# EAGLE design Motor Control (EAGLE 6.0)

## Sheet 1 of 2
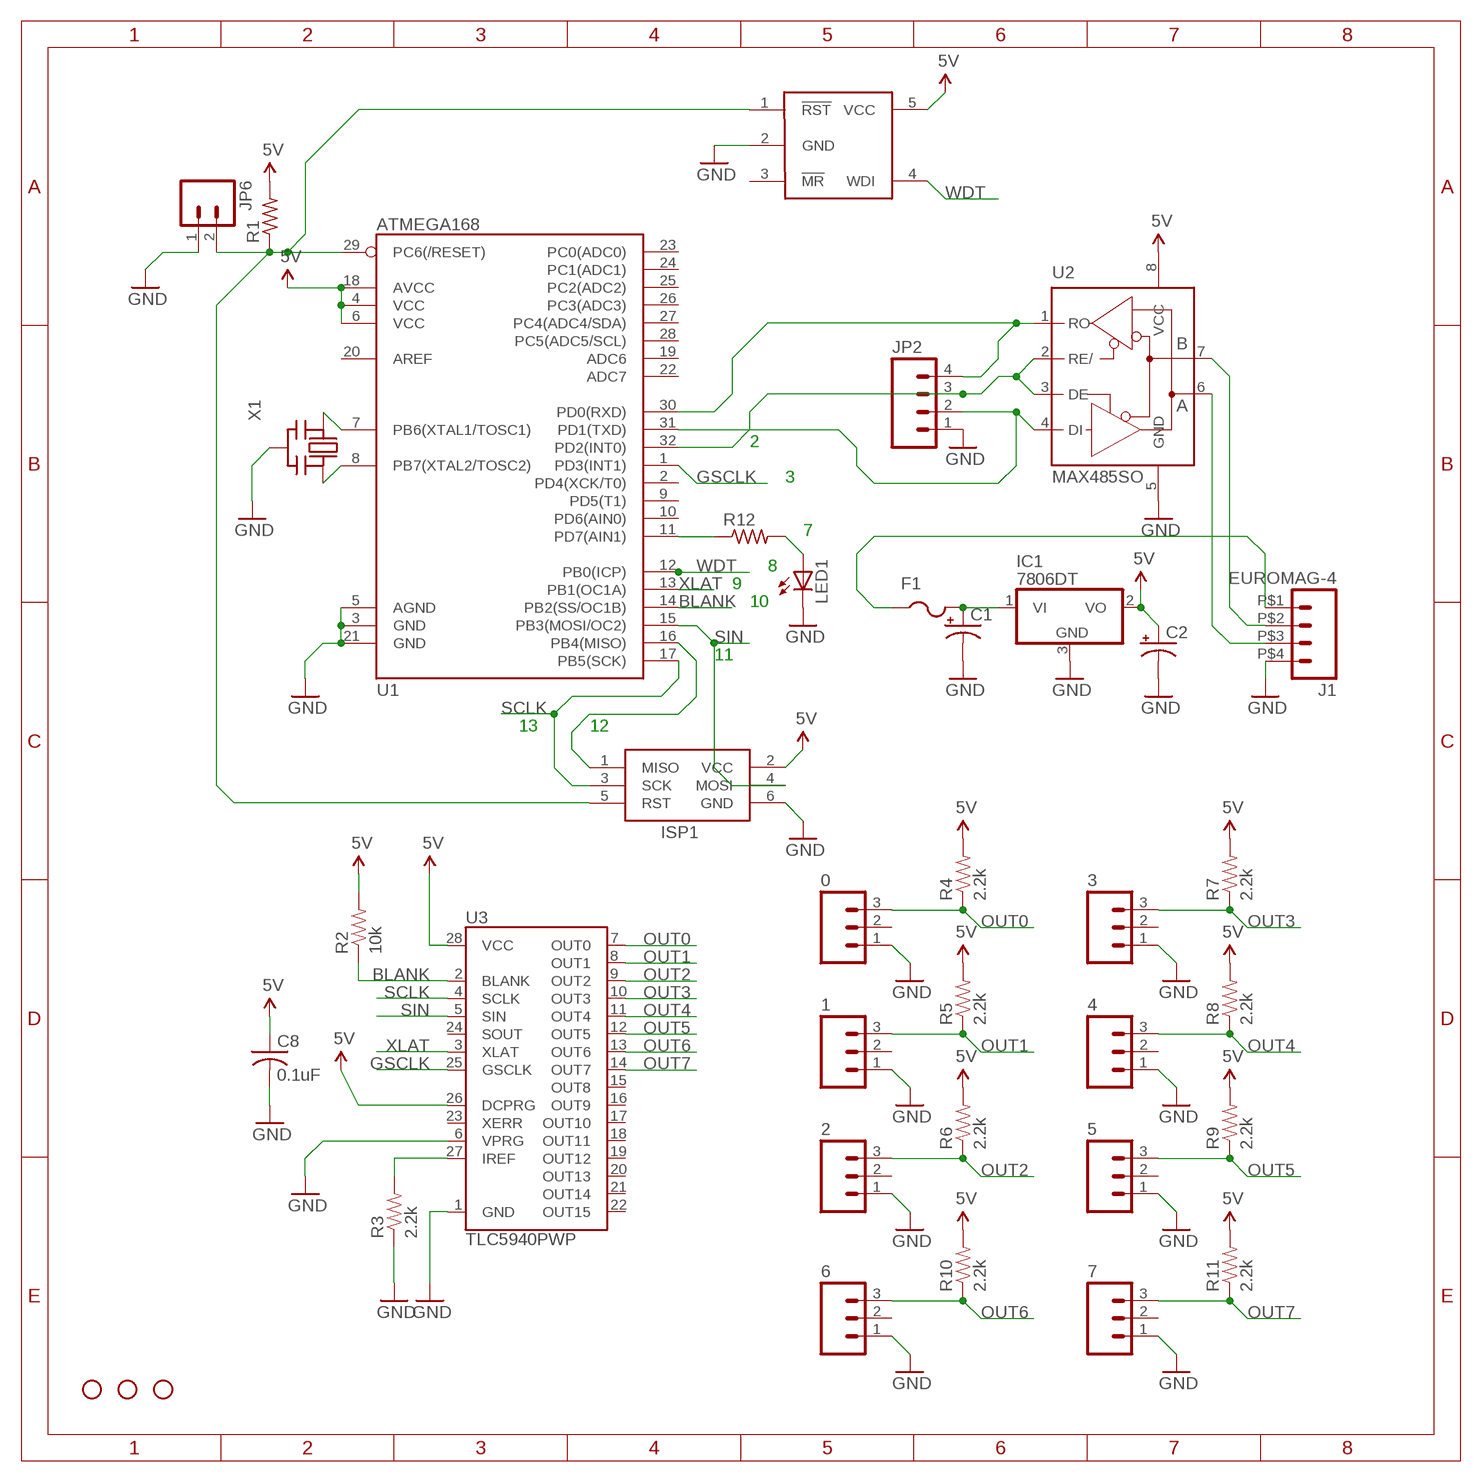
[diagram p0: schematic, sheet 1]

### Parts
0  M03PTH  [1X03]
1  M03PTH  [1X03]
2  M03PTH  [1X03]
3  M03PTH  [1X03]
4  M03PTH  [1X03]
5  M03PTH  [1X03]
6  M03PTH  [1X03]
7  M03PTH  [1X03]
C1  CPOL-USCT7343  [CT7343]
C2  CPOL-USCT6032  [CT6032]
C8  0.1uF  C-USC0603  [C0603]
F1  PTCFUSE-1812  [1812]
IC1  7806DT  [TO252]
ISP1  AVRISP-6  [AVRISP]
J1  EUROMAG-4  [M4]
JP2  M04PTH  [1X04]
JP3  STAND-OFF  [STAND-OFF]
JP4  STAND-OFF  [STAND-OFF]
JP5  STAND-OFF  [STAND-OFF]
JP6  M02LOCK_LONGPADS  [1X02_LOCK_LONGPADS]
LED1  LEDCHIPLED_0805  [CHIPLED_0805]
R1  R-US_M0805  [M0805]
R2  10k  RESISTOR0805-RES  [0805]
R3  2.2k  RESISTOR0805-RES  [0805]
R4  2.2k  RESISTOR0805-RES  [0805]
R5  2.2k  RESISTOR0805-RES  [0805]
R6  2.2k  RESISTOR0805-RES  [0805]
R7  2.2k  RESISTOR0805-RES  [0805]
R8  2.2k  RESISTOR0805-RES  [0805]
R9  2.2k  RESISTOR0805-RES  [0805]
R10  2.2k  RESISTOR0805-RES  [0805]
R11  2.2k  RESISTOR0805-RES  [0805]
R12  R-US_M0805  [M0805]
U1  ATMEGA168  [TQFP32-08]
U2  MAX485SO  [SO08]
U3  TLC5940PWP  [TSSOP28-GROUNDPAD]
U$18  MAX823  [SOT23-5L]
X1  CERMOSCILL-AWCSR  [AWCSR]

### Nets
5V: C2.+ C8.1 IC1.2(VO) ISP1.2(VCC) R1.2 R2.2 R4.2 R5.2 R6.2 R7.2 R8.2 R9.2 R10.2 R11.2 U1.4(VCC) U1.6(VCC) U1.18(AVCC) U2.8(VCC) U3.26(DCPRG) U3.28(VCC) U$18.5(VCC)
BLANK: R2.1 U1.14(PB2(SS/OC1B)) U3.2(BLANK)
GND: 0.1 1.1 2.1 3.1 4.1 5.1 6.1 7.1 C1.- C2.- C8.2 IC1.3(GND) ISP1.6(GND) J1.P$4 JP2.1 JP6.1 LED1.C R3.1 U1.3(GND) U1.5(AGND) U1.21(GND) U2.5(GND) U3.1(GND) U3.6(VPRG) U$18.2(GND) X1.2(GND) ; also sheet 2
GSCLK: U1.1(PD3(INT1)) U3.25(GSCLK)
N$1: JP2.3 U1.32(PD2(INT0)) U2.2(RE/) U2.3(DE)
N$2: JP2.4 U1.30(PD0(RXD)) U2.1(RO)
N$3: JP2.2 U1.31(PD1(TXD)) U2.4(DI)
N$4: ISP1.5(RST) JP6.2 R1.1 U1.29(PC6(/RESET)) U$18.1(!RST)
N$5: U1.8(PB7(XTAL2/TOSC2)) X1.3(OUT)
N$6: F1.1 J1.P$1
N$7: ISP1.1(MISO) U1.16(PB4(MISO))
N$8: C1.+ F1.2 IC1.1(VI)
N$9: U1.7(PB6(XTAL1/TOSC1)) X1.1(IN)
N$10: R3.2 U3.27(IREF)
N$11: J1.P$2 U2.7(B)
N$12: J1.P$3 U2.6(A)
N$17: R12.1 U1.11(PD7(AIN1))
N$20: LED1.A R12.2
OUT0: 0.3 R4.1 U3.7(OUT0)
OUT1: 1.3 R5.1 U3.8(OUT1)
OUT2: 2.3 R6.1 U3.9(OUT2)
OUT3: 3.3 R7.1 U3.10(OUT3)
OUT4: 4.3 R8.1 U3.11(OUT4)
OUT5: 5.3 R9.1 U3.12(OUT5)
OUT6: 6.3 R10.1 U3.13(OUT6)
OUT7: 7.3 R11.1 U3.14(OUT7)
SCLK: ISP1.3(SCK) U1.17(PB5(SCK)) U3.4(SCLK)
SIN: ISP1.4(MOSI) U1.15(PB3(MOSI/OC2)) U3.5(SIN)
WDT: U1.12(PB0(ICP)) U$18.4(WDI)
XLAT: U1.13(PB1(OC1A)) U3.3(XLAT)
Unconnected: 0.2 1.2 2.2 3.2 4.2 5.2 6.2 7.2 U1.2(PD4(XCK/T0)) U1.9(PD5(T1)) U1.10(PD6(AIN0)) U1.19(ADC6) U1.20(AREF) U1.22(ADC7) U1.23(PC0(ADC0)) U1.24(PC1(ADC1)) U1.25(PC2(ADC2)) U1.26(PC3(ADC3)) U1.27(PC4(ADC4/SDA)) U1.28(PC5(ADC5/SCL)) U3.15(OUT8) U3.16(OUT9) U3.17(OUT10) U3.18(OUT11) U3.19(OUT12) U3.20(OUT13) U3.21(OUT14) U3.22(OUT15) U3.23(XERR) U3.24(SOUT) U$18.3(!MR)

### Notes on the sheet
- 2
- 3
- 7
- 8
- 9
- 10
- 11
- 13 | 12

## Sheet 2 of 2
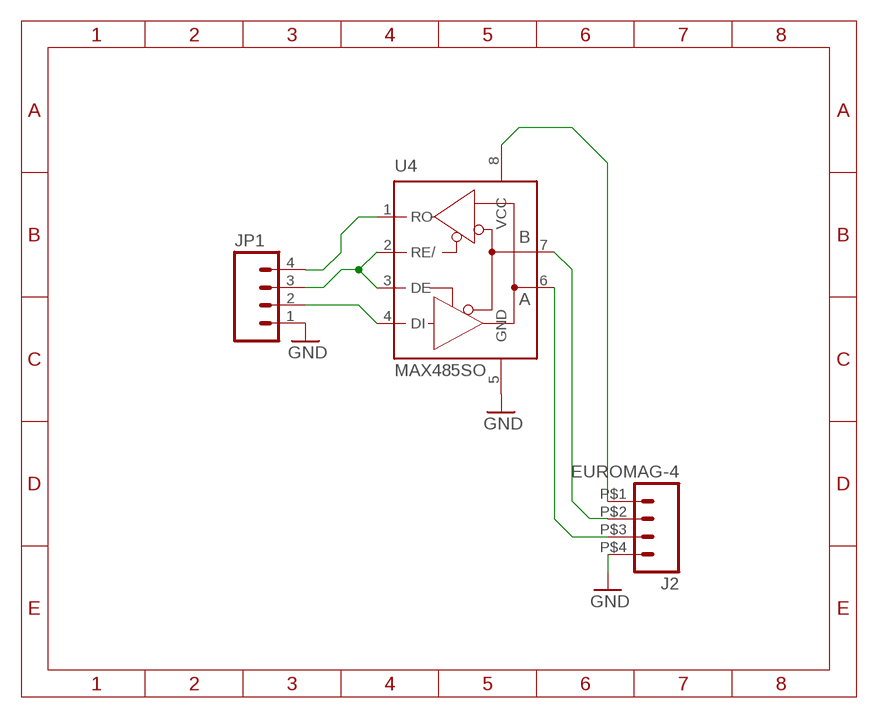
[diagram p1: schematic, sheet 2]

### Parts
J2  EUROMAG-4  [M4]
JP1  M04PTH  [1X04]
U4  MAX485SO  [SO08]

### Nets
GND: J2.P$4 JP1.1 U4.5(GND) ; also sheet 1
N$13: JP1.3 U4.2(RE/) U4.3(DE)
N$14: JP1.4 U4.1(RO)
N$15: JP1.2 U4.4(DI)
N$16: J2.P$1 U4.8(VCC)
N$18: J2.P$2 U4.7(B)
N$19: J2.P$3 U4.6(A)

## Library data of the parts
0 1-7 = SparkFun:M03: Header 3 Standard 3-pin 0.1" header. Use with straight break away headers (SKU : PRT-00116), right angle break away headers (PRT-00553), swiss pins (PRT-00743), machine pins (PRT-00117), and female headers (PRT-00115). Molex polarized connector foot print use with SKU : PRT-08232 with associated crimp pins and housings.
C1 C2 = adafruit:CPOL-US: POLARIZED CAPACITOR, American symbol
C8 = minimidi:C-US: CAPACITOR, American symbol
F1 = adafruit:PTCFUSE: PTC fuses, resettable thermistors
IC1 = adafruit:78*: Positive VOLTAGE REGULATOR Added bigger pads to the TO-92 package
ISP1 = adafruit:AVRISP: AVR ISP HEADER Standard 6 pin header for AVR programming
J1 J2 = NASA_LIB:EUROMAG-4
JP1 JP2 = SparkFun:M04: Header 4 Standard 4-pin 0.1" header. Use with straight break away headers (SKU : PRT-00116), right angle break away headers (PRT-00553), swiss pins (PRT-00743), machine pins (PRT-00117), and female headers (PRT-00115). Molex polarized connector foot print use with SKU : PRT-08231 with associated crimp pins and housings. 1MM SMD Version SKU: PRT-10208
JP3-JP5 = SparkFun:STAND-OFF: Stand Off This is the mechanical footprint for a #4 phillips button head screw. Use the keepout ring to avoid running the screw head into surrounding components. SKU : PRT-00447
JP6 = SparkFun:M02: Header 2 Standard 2-pin 0.1" header. Use with straight break away headers (SKU : PRT-00116), right angle break away headers (PRT-00553), swiss pins (PRT-00743), machine pins (PRT-00117), and female headers (PRT-00115). Molex polarized connector foot print use with SKU : PRT-08233 with associated crimp pins and housings.
LED1 = adafruit:LED: LED OSRAM: - CHIPLED LG R971, LG N971, LY N971, LG Q971, LY Q971, LO R971, LY R971 LH N974, LH R974 LS Q976, LO Q976, LY Q976 LO Q996 - Hyper CHIPLED LW Q18S LB Q993, LB Q99A, LB R99A - SideLED LS A670, LO A670, LY A670, LG A670, LP A670 LB A673, LV A673, LT A673, LW A673 LH A674 LY A675 LS A676, LA A676, LO A676, LY A676, LW A676 LS A679, LY A679, LG A679 - Hyper Micro SIDELED® LS Y876, LA Y876, LO Y876, LY Y876 LT Y87S - SmartLED LW L88C, LW L88S LB L89C, LB L89S, LG L890 LS L89K, LO L89K, LY L89K LS L896, LA L896, LO L896, LY L896 - TOPLED LS T670, LO T670, LY T670, LG T670, LP T670 LSG T670, LSP T670, LSY T670, LOP T670, LYG T670 LG T671, LOG T671, LSG T671 LB T673, LV T673, LT T673, LW T673 LH T674 LS T676, LA T676, LO T676, LY T676, LB T676, LH T676, LSB T676, LW T676 LB T67C, LV T67C, LT T67C, LS T67K, LO T67K, LY T67K, LW E67C LS E67B, LA E67B, LO E67B, LY E67B, LB E67C, LV E67C, LT E67C LW T67C LS T679, LY T679, LG T679 LS T770, LO T770, LY T770, LG T770, LP T770 LB T773, LV T773, LT T773, LW T773 LH T774 LS E675, LA E675, LY E675, LS T675 LS T776, LA T776, LO T776, LY T776, LB T776 LHGB T686 LT T68C, LB T68C - Hyper Mini TOPLED® LB M676 - Mini TOPLED Santana® LG M470 LS M47K, LO M47K, LY M47K Source: http://www.osram.convergy.de/
R1 R12 = adafruit:R-US_: RESISTOR, American symbol
R2-R11 = SparkFun:RESISTOR: Resistor Basic schematic elements and footprints for 0603, 1206, and PTH resistors.
U1 = SparkFun:ATMEGA168
U2 U4 = NASA_LIB:MAX485
U3 = SparkFun:TLC5940: TI TLC5940 16-channel LED Driver with Dot Correction and Grayscale PWM Control The TLC5940 is a 16-channel, constant-current sink LED driver. Each channel has an individually adjustable 4096-step grayscale PWM brightness control and a 64-step, constant-current sink (dot correction). The dot correction adjusts the brightness variations between LED channels and other LED drivers. The dot correction data is stored in an integrated EEPROM. Both grayscale control and dot correction are accessible via a serial interface. A single external resistor sets the maximum current value of all 16 channels. Packages: 28-pin HTSSOP 32-pin 5x5mm QFN 28-pin DIP
U$18 = NASA_LIB:MAX823
X1 = adafruit:CERMOSCILL: Ceramic oscillator with built in capacitors such as ZTT-12MHz http://www.ladyada.net/library/eagle

## Board
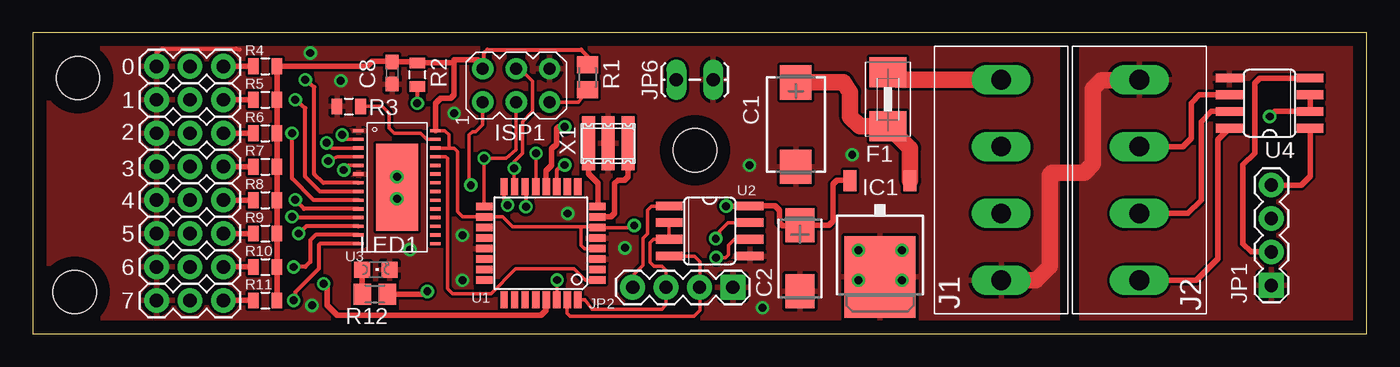
[diagram p2: board, top side]
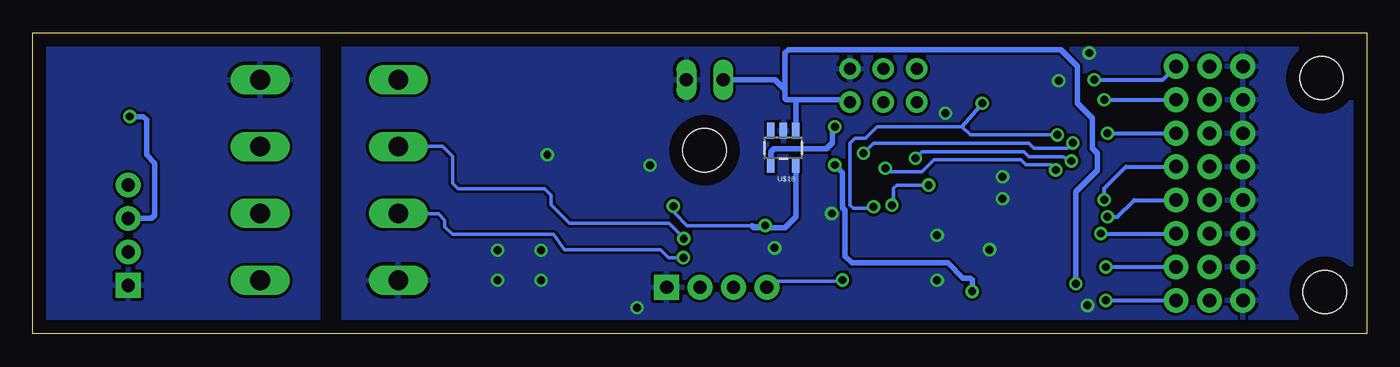
[diagram p3: board, bottom side, seen from below]

Size 101.35 x 22.86 mm. Coordinates in mm from the lower left corner, seen from the top.
Outline: 0,0 101.35,0 101.35,22.86 0,22.86 0,0
Copper layers (1*16): Top 0.035mm / dielectric 1.5mm / Bottom 0.035mm
Design rules: minimum track width 10mil, minimum drill 24mil, track to track 8mil, track to pad 8mil, pad to pad 8mil, via to via 8mil, smd to smd 8mil, copper to edge 40mil, drill to drill 8mil, minimum pad ring 10mil, minimum via ring 8mil, stop-mask expansion 4mil, vias tented up to drill 0mil, thermal gap 10mil
tRestrict: area 78.3,-0.1 to 79.3,22.9
bRestrict: area 78.1,-0.1 to 79.3,22.9

### Footprints (pad centres in the part's own frame; a part is rotated, then mirrored left to right if it is on the bottom)
1X03 = drill 1.016 pad 1.88: 1 0,0; 2 2.54,0; 3 5.08,0
CT7343 = smd 2.6 x 2.4: + 3.2,0; - -3.2,0
CT6032 = smd 2.6 x 2.2: + 2.5,0; - -2.5,0
C0603 = smd 1.1 x 1: 1 -0.85,0; 2 0.85,0
1812 = smd 2.286 x 2.794: 1 -2.046,0; 2 2.046,0
TO252 = smd 1 x 1.6: 1 -2.28,-4.8; 2 2.28,-4.8 | smd 5.4 x 6.2: 3 0,2.5
AVRISP = drill 0.9 pad 1.626: 1 -1.27,2.54; 2 1.27,2.54; 3 -1.27,0; 4 1.27,0; 5 -1.27,-2.54; 6 1.27,-2.54
M4 = drill 1.5 long: P$1 0,0; P$2 5.08,0; P$3 10.16,0; P$4 15.24,0
1X04 = drill 1.016 pad 1.88 square: 1 0,0 | drill 1.016 pad 1.88: 2 2.54,0; 3 5.08,0; 4 7.62,0
STAND-OFF = hole 3.302: 0,0
1X02_LOCK_LONGPADS = drill 1.016 long: 1 -0.127,0; 2 2.667,0
CHIPLED_0805 = smd 1.2 x 1.2: A 0,-1.05; C 0,1.05
M0805 = smd 1.3 x 1.6: 1 -0.95,0; 2 0.95,0
0805 = smd 0.8 x 1.2: 1 -0.9,0; 2 0.9,0
TQFP32-08 = smd 1.27 x 0.559: 1 -4.293,2.8; 2 -4.293,2; 3 -4.293,1.2; 4 -4.293,0.4; 5 -4.293,-0.4; 6 -4.293,-1.2; 7 -4.293,-2; 8 -4.293,-2.8; 17 4.293,-2.8; 18 4.293,-2; 19 4.293,-1.2; 20 4.293,-0.4; 21 4.293,0.4; 22 4.293,1.2; 23 4.293,2; 24 4.293,2.8 | smd 0.559 x 1.27: 9 -2.8,-4.293; 10 -2,-4.293; 11 -1.2,-4.293; 12 -0.4,-4.293; 13 0.4,-4.293; 14 1.2,-4.293; 15 2,-4.293; 16 2.8,-4.293; 25 2.8,4.293; 26 2,4.293; 27 1.2,4.293; 28 0.4,4.293; 29 -0.4,4.293; 30 -1.2,4.293; 31 -2,4.293; 32 -2.8,4.293
SO08 = smd 0.66 x 2.032: 1 -1.905,-3.073; 2 -0.635,-3.073; 3 0.635,-3.073; 4 1.905,-3.073; 5 1.905,3.073; 6 0.635,3.073; 7 -0.635,3.073; 8 -1.905,3.073
TSSOP28-GROUNDPAD = smd 0.8 x 0.25: 1 -2.921,4.298; 2 -2.921,3.637; 3 -2.921,2.977; 4 -2.921,2.317; 5 -2.921,1.656; 6 -2.921,0.996; 7 -2.921,0.335; 8 -2.927,-0.325; 9 -2.921,-0.985; 10 -2.921,-1.646; 11 -2.921,-2.306; 12 -2.921,-2.967; 13 -2.921,-3.627; 14 -2.921,-4.287; 15 2.921,-4.287; 16 2.921,-3.627; 17 2.921,-2.967; 18 2.921,-2.306; 19 2.921,-1.646; 20 2.921,-0.985; 21 2.927,-0.325; 22 2.921,0.335; 23 2.921,0.996; 24 2.921,1.656; 25 2.921,2.317; 26 2.921,2.977; 27 2.921,3.637; 28 2.921,4.298 | smd 3.2 x 6.6: 29 0,0.005
SOT23-5L = smd 0.55 x 1.2: 1 -0.95,-1.3; 2 0,-1.3; 3 0.95,-1.3; 4 0.95,1.3; 5 -0.95,1.3
AWCSR = smd 1 x 4.1: 1 -1.5,0; 2 0,0; 3 1.5,0

### Placement (x,y rotation side)
0  9.4,20.32 0 top
1  9.4,17.78 0 top
2  9.4,15.24 0 top
3  9.4,12.7 0 top
4  9.4,10.16 0 top
5  9.4,7.62 0 top
6  9.4,5.08 0 top
7  9.4,2.54 0 top
C1  57.98,15.89 90 top
C2  58.29,5.74 90 top
C8  27.3,19.81 270 top
F1  64.98,17.82 270 top
IC1  64.37,6.83 180 top
ISP1  36.72,18.87 90 top
J1  73.58,19.3 270 top
J2  84.07,4.06 90 top
JP1  94.11,3.68 90 top
JP2  53.19,3.54 180 top
JP3  3.17,3.17 0 top
JP4  3.43,19.43 0 top
JP5  50.32,13.94 0 top
JP6  51.56,19.3 180 top
LED1  26.06,4.88 270 top
R1  42.14,19.48 90 top
R2  29.21,19.68 90 top
R3  24,17.27 0 top
R4  17.65,20.32 0 top
R5  17.65,17.78 0 top
R6  17.65,15.24 0 top
R7  17.65,12.7 0 top
R8  17.65,10.16 0 top
R9  17.65,7.62 0 top
R10  17.65,5.08 0 top
R11  17.65,2.54 0 top
R12  25.98,3.02 180 top
U1  38.6,6.88 180 top
U2  51.42,7.82 270 top
U3  27.67,11.14 0 top
U4  93.98,17.53 90 top
U$18  44.32,14.12 180 bottom
X1  43.71,14.46 180 top

### Tracks (layer width: path | path; a pad name or v marks a point on that pad's centre or on a via)
5V  (via drill 0.6)
  Top 0.254: U3.28 31.3,15.44 31.62,15.11 31.62,14.22 31.5,14.1 | 31.5,14.1 30.61,14.1 U3.26 | 31.5,14.1 32,14.1 32.26,13.84 32.26,9.27 32.64,8.89 34.3,8.89 U1.18 35.7,8.88 36.45,8.13 41.66,8.13 | 41.66,8.13 42.85,8.13 U1.6 45.54,8.08 v45.7,8.23 | U1.4 41.91,6.48 41.66,6.73 41.66,8.13 | 54.43,9.7 54.46,9.73 54.49,9.73 U2.8
  Top 0.305: 34.29,20.19 34.29,21.34 34.54,21.59 41.66,21.59 42.16,21.08 42.16,20.83 41.91,20.57 41.99,20.57 R1.2
  Top 0.406: R11.2 R10.2 R9.2 R8.2 R7.2 R6.2 R5.2 R4.2 25.4,20.32 25.78,20.7 27.01,20.7 C8.1 29.13,20.66 R2.2 31.89,20.59 32,20.7 | 34.1,20.51 33.78,20.83 32,20.83 32,20.7 | 34.1,20.51 34.16,20.45 | 34.1,20.51 34.11,20.52 ISP1.2 34.18,20.21 34.29,20.32 34.29,20.19 34.16,20.07 | U3.28 30.59,17.51 30.99,17.91 31.75,17.91 32,18.16 32,20.7 | 42.16,20.45 R1.2 | v52.68,9.7 54.48,9.7 U2.8 | 54.49,9.73 56.39,9.73 56.74,9.37 56.74,8.46 56.97,8.23 58.28,8.23 C2.+ 60.49,8.24 60.81,8.56 60.81,11.38 61.09,11.66 62.06,11.66 IC1.2
  Bottom 0.254: v45.7,8.23 46.69,8.23 51.64,8.23 52.6,9.2 52.6,9.63 v52.68,9.7
  Bottom 0.406: U$18.5 43.37,8.9 44.2,8.08 46.53,8.08 46.69,8.23
BLANK  (via drill 0.6)
  Top 0.254: U3.2 23.83,14.78 v23.5,15.11 | v37.47,9.65 37.47,11.11 U1.14
  Top 0.305: R2.1 v29.21,17.53
  Bottom 0.254: v23.5,15.11 30.1,15.11 30.73,15.75 37.21,15.75 38.1,14.86 38.86,14.86 39.24,14.48 39.24,9.78 38.99,9.53 37.59,9.53 v37.47,9.65
  Bottom 0.305: v29.21,17.53 30.73,15.75
GND  (via drill 0.6)
  Top 0.305: 0.1 9.4,21.34 9.83,21.67 15.42,21.67 15.75,21.59
  Top 1.27: J1.P$4 76.2,4.06 77.27,5.13 77.27,12.09 77.42,12.24 79.88,12.24 80.54,12.9 80.54,18.62 81.2,19.28 84.15,19.28 84.2,19.33 84.2,19.36 84.23,19.38 84.18,19.38 84.1,19.46 | 84,19.3 83.9,19.3 83.8,19.2 83.9,19.2 84,19.3 | 84,19.3 J2.P$4 84.12,19.36
  other vias: 32,16.76 40.64,9.14 21.21,2.16 21.08,21.34 23.39,19.23 44.98,6.53 54.46,12.8 62.26,13.61 62.74,6.35 66.04,6.35 66.04,4.06 62.74,4.06 55.45,1.98 32.64,7.49 32.64,4.06 28.65,6.4 27.66,10.26 27.66,11.94
  pour Top: 0,22.86 101.35,22.86 101.35,0 0,0
  pour Bottom: 0,22.86 101.35,22.86 101.35,0 0,0
GSCLK
  Top 0.254: U3.25 30.73,13.45 30.73,13.46 31.37,13.46 31.5,13.34 31.5,3.43 31.88,3.05 34.8,3.05 36.68,4.93 41.12,4.93 41.99,4.06 42.8,4.06 | 42.8,4.06 42.93,4.06 | U1.1 42.81,4.08 42.8,4.06
N$1
  Top 0.254: U1.32 41.94,2.59 42.49,1.85 47.8,1.85 48.11,2.26 JP2.3 48.11,4.82 47.8,5.13 47.19,5.13 46.89,5.44 46.89,6.93 47.14,7.19 U2.3 U2.2
N$2  (via drill 0.6)
  Top 0.254: v39.83,4.09 39.83,2.64 39.8,2.62 U1.30 | JP2.4 45.67,3.63 45.67,4.52 46.35,5.21 46.35,7.26 46.69,7.59 46.69,9.37 47.02,9.7 48.16,9.7 | 48.16,9.7 48.26,9.7 | U2.1 48.18,9.72 48.16,9.7
  Bottom 0.254: v39.83,4.09 39.9,3.99 45.12,3.99 JP2.4
N$3
  Top 0.254: U2.4 50.27,5.91 50.7,5.49 50.7,3.56 50.68,3.54 JP2.2 50.67,3.52 50.67,1.78 50.24,1.35 40.82,1.35 40.6,1.56 U1.31
N$4  (via drill 0.6)
  Top 0.254: ISP1.5 41.46,17.6 R1.1
  Top 0.406: U1.29 39,1.79 38.61,1.4 23.11,1.4 22.35,2.16 22.35,3.56 v22.1,3.81
  Bottom 0.406: v22.1,3.81 22.1,10.79 20.45,12.45 20.45,13.72 20.83,14.1 20.83,16.38 21.97,17.53 21.97,20.32 23.24,21.59 43.94,21.59 44.2,21.34 44.2,18.54 | 44.2,18.54 44.2,17.91 44.07,17.78 43.38,17.78 | 43.38,17.78 39.44,17.78 ISP1.5 | JP6.2 44.96,19.3 44.2,18.54 | U$18.1 43.37,17.72 43.38,17.73 43.38,17.78
N$5
  Top 0.406: X1.3 42.21,12.14 42.93,11.43 42.93,9.65 U1.8
N$6
  Top 1.27: J1.P$1 65.66,19.3 65.02,19.94 | 65.02,19.94 64.9,19.94 F1.1 | 65.02,19.94 65.15,19.94
N$7  (via drill 0.6)
  Top 0.254: ISP1.1 34.18,15.89 33.66,15.37 33.4,15.37 33.15,15.11 33.15,11.43 v33.27,11.3 | v36.07,9.78 36.07,9.91 35.81,10.16 35.81,11.18 U1.16
  Bottom 0.254: v33.27,11.3 35.69,11.3 35.94,11.05 35.94,9.91 v36.07,9.78
N$8
  Top 1.27: C1.+ 58.39,19.13 61.59,19.13 62.1,18.36 62.1,16.51 62.84,15.77 F1.2 66.65,14.11 IC1.1
N$9
  Top 0.406: U1.7 43.93,8.88 44.2,9.14 44.2,11.43 44.45,11.68 44.96,11.68 45.21,11.94 X1.1
N$10
  Top 0.254: R3.2 26.54,17.27 27.05,16.76 27.05,15.62 27.43,15.24 29.46,15.24 29.92,14.78 U3.27
N$11  (via drill 0.6)
  Top 0.254: U2.7 52.82,8.45 52.17,7.8 52.17,7.52 v51.89,7.24
  Bottom 0.254: v51.89,7.24 51.89,7.29 53.01,8.41 60.58,8.41 61.98,9.8 61.98,10.52 62.48,11.02 69.04,11.02 69.44,11.43 69.44,13.49 70.21,14.25 73.55,14.25 J1.P$2
N$12  (via drill 0.6)
  Top 0.254: U2.6 53.31,7.18 52.86,6.73 52.86,6.02 52.63,5.79 v51.92,5.79
  Bottom 0.254: v51.92,5.79 53.03,5.79 53.65,6.4 60.94,6.4 61.8,7.57 69.47,7.57 70.05,8.15 70.05,8.64 70.54,9.12 73.55,9.12 J1.P$3
N$13  (via drill 0.6)
  Top 0.406: U4.3 U4.2 94.36,16.89 v93.98,16.51
  Bottom 0.406: v93.98,16.51 92.96,16.51 92.71,16.26 92.71,13.59 92.08,12.95 92.08,9.02 92.33,8.76 JP1.3
N$14
  Top 0.406: U4.1 97.05,11.96 96.39,11.3 JP1.4
N$15
  Top 0.406: U4.4 93.22,19.43 92.84,19.05 92.84,13.72 91.95,12.83 91.95,6.86 92.58,6.22 JP1.2
N$16
  Top 0.406: J2.P$1 88.39,4.06 90.04,5.71 90.04,14.76 U4.8
N$17  (via drill 0.6)
  Top 0.305: v40.41,12.83 40.21,12.83 39.8,12.42 U1.11
  Top 0.406: R12.1 29.77,3.02 v29.97,3.23
  Bottom 0.406: v29.97,3.23 29.97,4.12 30.1,4.24 30.66,4.24 31.8,5.38 39.12,5.38 39.62,5.89 39.62,9.37 39.83,9.58 39.83,12.24 v40.41,12.83
N$18
  Top 0.406: J2.P$2 87.76,9.14 88.77,10.16 88.77,16.13 89.53,16.89 U4.7
N$19
  Top 0.406: J2.P$3 87.38,14.22 88.01,14.86 88.01,17.53 88.65,18.16 U4.6 91.06,18.16
N$20
  Top 0.406: LED1.A 25.01,3.08 25.04,3.05 25.04,3.03 R12.2
OUT0  (via drill 0.6)
  Top 0.305: U3.7 22.05,11.47 21.39,12.14 21.39,18.75 v20.7,19.3
  Top 0.406: 0.3 R4.1 16.76,20.32
  Bottom 0.305: v20.7,19.3 15.49,19.3 0.3
OUT1  (via drill 0.6)
  Top 0.305: U3.8 21.83,10.81 20.7,11.94 20.7,17.14 v19.94,17.78
  Top 0.406: 1.3 R5.1
  Bottom 0.305: v19.94,17.78 1.3
OUT2  (via drill 0.6)
  Top 0.305: U3.9 21.34,10.15 19.68,11.81 v19.68,15.24
  Top 0.406: 2.3 R6.1
  Bottom 0.305: v19.68,15.24 2.3
OUT3  (via drill 0.6)
  Top 0.305: U3.10 20.61,9.49 v19.94,10.19
  Top 0.406: 3.3 R7.1
  Bottom 0.305: v19.94,10.19 19.94,11.05 18.29,12.7 3.3
OUT4  (via drill 0.6)
  Top 0.305: U3.11 19.74,8.83 v19.68,8.89
  Top 0.406: 4.3 R8.1
  Bottom 0.305: v19.68,8.89 18.92,8.89 17.65,10.16 4.3
OUT5  (via drill 0.6)
  Top 0.305: U3.12 20.74,8.17 v20.19,7.62
  Top 0.406: 5.3 R9.1
  Bottom 0.305: v20.19,7.62 5.3
OUT6  (via drill 0.6)
  Top 0.305: U3.13 21.48,7.51 21.08,7.11 21.08,5.46 20.7,5.08 v19.81,5.08
  Top 0.406: 6.3 R10.1
  Bottom 0.305: v19.81,5.08 6.3
OUT7  (via drill 0.6)
  Top 0.305: U3.14 21.84,6.85 21.72,6.73 21.72,4.95 19.94,3.17 19.94,2.67 v19.81,2.54
  Top 0.406: 7.3 R11.1
  Bottom 0.305: v19.81,2.54 7.3
SCLK  (via drill 0.6)
  Top 0.254: U3.4 23.11,13.45 v22.43,13.13 | U1.17 34.29,9.7 v34.29,13.34 35.94,13.34 36.72,13.99 ISP1.3
  Bottom 0.254: v22.43,13.13 23.09,13.46 25.65,13.46 26.04,13.84 33.78,13.84 v34.29,13.34
SIN  (via drill 0.6)
  Top 0.254: U3.5 23.97,12.79 v23.62,12.45 | U1.15 36.58,11.2 v36.58,12.57 36.58,13.08 37.21,13.72 37.21,16.13 37.97,16.89 37.97,19.18 37.01,20.14 ISP1.4
  Bottom 0.254: v23.62,12.45 24,12.83 25.91,12.83 26.29,13.21 32.89,13.21 33.78,12.32 36.32,12.32 v36.58,12.57
WDT  (via drill 0.6)
  Top 0.406: v40.41,15.72 39.93,15.72 39.78,15.57 39.78,14.4 39.6,14.22 | 39.6,14.22 39.57,14.2 | U1.12 39,12.38 39.42,12.8 39.42,14.05 39.57,14.2 | 39.57,14.2 39.57,14.22 39.6,14.25 39.6,14.22
  Bottom 0.406: U$18.4 45.27,13.83 45.03,14.07 41.05,14.07 40.59,14.53 40.59,15.54 v40.41,15.72
XLAT  (via drill 0.6)
  Top 0.254: U3.3 22.71,14.12 v22.33,14.5 | v38.23,13.72 38.23,11.2 U1.13
  Bottom 0.254: v22.33,14.5 22.73,14.1 25.27,14.1 25.65,14.48 37.47,14.48 v38.23,13.72